# Altium schematic sheet power-v2v5.SchDoc: Copper Suicide - Power 2.5V
size Letter; CheckedBy: J. Brinton; CompanyName: Signal Laboratories, Inc.; DrawnBy: J. Brinton; Engineer: J. Brinton; Address1: 3479 Edison Way; Address2: Menlo Park CA 94025; Address3: +1 (877) 778-8435; Address4: siglabs.com; Revision: 3; SheetNumber: 43; SheetTotal: 47
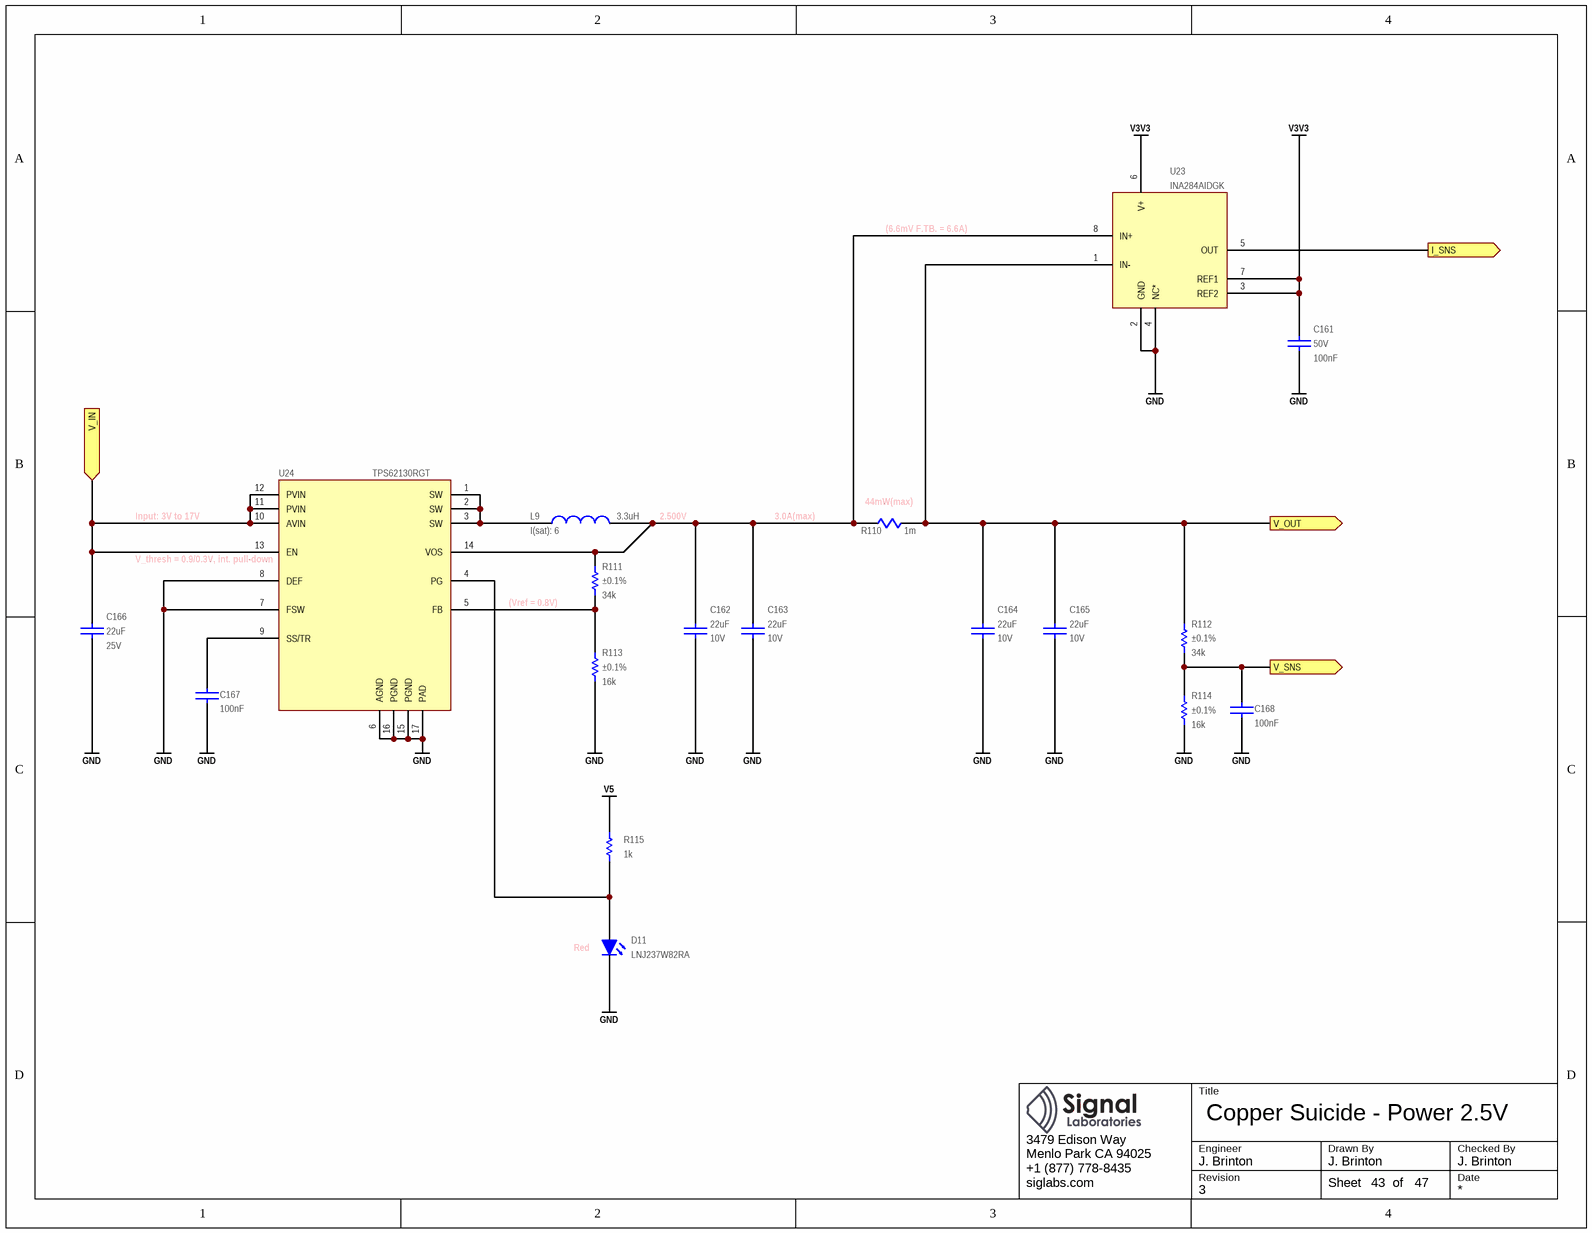
[diagram p0: power-v2v5.SchDoc]

## Parts
C161  value 100nF  Voltage: 50V  [CAPC100X50X55L25N]  (hidden comment: GCM155R71H104KE02)
C162  value 22uF  Voltage: 10V  [CAPC200X125X145L45N]  (hidden comment: C2012X7S1A226M125)
C163  value 22uF  Voltage: 10V  [CAPC200X125X145L45N]  (hidden comment: C2012X7S1A226M125)
C164  value 22uF  Voltage: 10V  [CAPC200X125X145L45N]  (hidden comment: C2012X7S1A226M125)
C165  value 22uF  Voltage: 10V  [CAPC200X125X145L45N]  (hidden comment: C2012X7S1A226M125)
C166  value 22uF  Voltage: 25V  [CAPC320X250X270L50N]  (hidden comment: GRM32ER71E226KE15)
C167  value 100nF  [CAPC100X50X55L25N]  (hidden comment: GCM155R71H104KE02)
C168  value 100nF  [CAPC100X50X55L25N]  (hidden comment: GCM155R71H104KE02)
D11  LNJ237W82RA  [0603_LED]
L9  value 3.3uH  I(sat): 6  [XAL6030]  (hidden comment: XAL6030-332ME)
R110  value 1m  [RESC3216X80L110N]  (hidden comment: CSR1206-0R001F1)
R111  value 34k  Tolerance: ±0.1%  [RESC2012X70N]  (hidden comment: ERA-6AEB3402V)
R112  value 34k  Tolerance: ±0.1%  [RESC2012X70N]  (hidden comment: ERA-6AEB3402V)
R113  value 16k  Tolerance: ±0.1%  [RESC2012X70N]  (hidden comment: ERA-6AEB163V)
R114  value 16k  Tolerance: ±0.1%  [RESC2012X70N]  (hidden comment: ERA-6AEB163V)
R115  value 1k  [RESC1005X40N]  (hidden comment: ERJ-2RKF1001X)
U23  INA284AIDGK  [S-PDSO-G8]
U24  TPS62130RGT  [S-PQFP-8N]

## Ports
I_SNS (out), V_IN (in), V_OUT (out), V_SNS (out)

## Nets
GND: C161.1 C162.1 C163.1 C164.1 C165.1 C166.1 C167.1 C168.1 D11.2(K) R113.1 R114.1 U23.2(GND) U23.4(NC*) U24.6(AGND) U24.7(FSW) U24.8(DEF) U24.15(PGND) U24.16(PGND) U24.17(PAD)
V3V3: C161.2 U23.3(REF2) U23.6(V+) U23.7(REF1)
V5: R115.2
I_SNS: U23.5(OUT) ; port I_SNS
V_IN: C166.2 U24.10(AVIN) U24.11(PVIN) U24.12(PVIN) U24.13(EN) ; port V_IN
V_OUT: C164.2 C165.2 R110.2 R112.2 U23.1(IN-) ; port V_OUT
V_SNS: C168.2 R112.1 R114.2 ; port V_SNS
NetC162_2: C162.2 C163.2 L9.2 R110.1 R111.2 U23.8(IN+) U24.14(VOS)
NetC167_2: C167.2 U24.9(SS/TR)
NetD11_1: D11.1(A) R115.1 U24.4(PG)
NetL9_1: L9.1 U24.1(SW) U24.2(SW) U24.3(SW)
NetR111_1: R111.1 R113.2 U24.5(FB)

## Notes on the sheet
- (6.6mV F.TB. = 6.6A)
- Input: 3V to 17V
- 2.500V
- (near R110) 3.0A(max)
- (near R110) 44mW(max)
- (near U24) V_thresh = 0.9/0.3V, int. pull-down
- (near R111) (Vref = 0.8V)
- (near D11) Red
- Title
- Engineer
- Revision
- Drawn By
- Checked By
- Date
- Sheet
- of

## Library data of the parts
C161 C167 C168 = CAP: Ceramic Capacitor 100nF ±10% 50V X7R 0402; Manufacturer: Murata; Tr: -55:125; Manufacturer P/N: GCM155R71H104KE02; Tolerance: ±10%; Package: 0402
  C167 C168: Voltage: 50V; Footprint: *
C162-C165 = CAP: Ceramic Capacitor 22uF ±20% 10V X7S 0805; Manufacturer: TDK; Tr: -55:125; Manufacturer P/N: C2012X7S1A226M125; Tolerance: ±20%; Package: 0805
C166 = CAP: Ceramic Capacitor 22uF ±10% 25V X7R 1210; Manufacturer: Murata; Tr: -55:125; Manufacturer P/N: GRM32ER71E226KE15; Tolerance: ±10%; Package: 1210
D11 = LED0603RD: LED, SMT 0603, Color Red, 5mA, 1.85V; Manufacturer: Panasonic; Manufacturer P/N: LNJ237W82RA; Package: 0603 Polarized
L9 = INDUCTOR: Shielded Power Inductor 3.3uH, 6A; Manufacturer: Coilcraft; Manufacturer P/N: XAL6030-332ME
R110 = CSR1206-0R001F1: Current Sense Resistor 1mOhm +/-1% SMD 1206; Manufacturer: Riedon; Manufacturer P/N: CSR1206-0R001F1; Package: 1206
R111 R112 = RES: Thin Film Resistor 34k ±0.1% 0.125W 100V 0805; Manufacturer: Panasonic; Tcr: ±25; Tr: -55:155; Voltage: 100; Power: 0.125; Manufacturer P/N: ERA-6AEB3402V; Package: 0805
R113 R114 = RES: Thin Film Resistor 16k ±0.1% 0.125W 100V 0805; Manufacturer: Panasonic; Tcr: ±25; Tr: -55:155; Voltage: 100; Power: 0.125; Manufacturer P/N: ERA-6AEB163V; Package: 0805
R115 = RES: Thick Film Resistor 1k ±1% 0.1W 50V 0402; Manufacturer: Panasonic; Tcr: ±100; Tr: -55:155; Voltage: 50; Power: 0.1; Manufacturer P/N: ERJ-2RKF1001X; Tolerance: ±1%; Alternatives: *; Footprint: *; Package: 0402
U23 = INA283AIDGK: Bidirectional Current Shunt Monitor; Manufacturer: Texas Instruments; Manufacturer P/N: INA284AIDGK
U24 = TPS62130RGT: 3-17V 3A Step-Down Converter VQFN; Manufacturer: Texas Instruments; Manufacturer P/N: TPS62130RGT